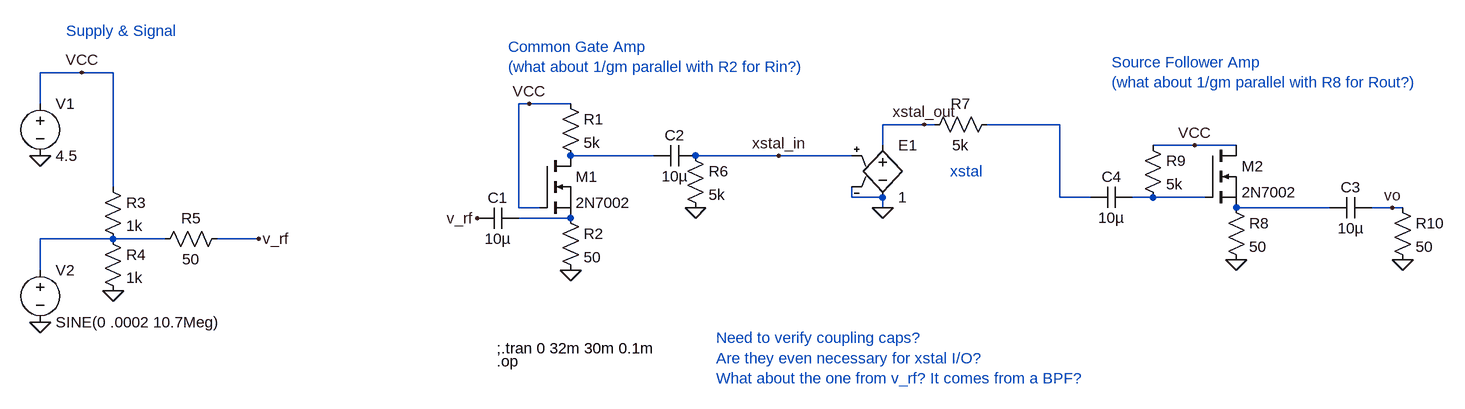
[diagram p0: schematic MOSFET_impedance_matching.asc]
MOSFET_impedance_matching.asc, the LTspice schematic file:
Version 4
SHEET 1 1732 680
WIRE -384 -144 -448 -144
WIRE -336 -144 -384 -144
WIRE -448 -96 -448 -144
WIRE 304 -96 288 -96
WIRE 368 -96 304 -96
WIRE 912 -64 848 -64
WIRE 928 -64 912 -64
WIRE 1120 -64 1008 -64
WIRE 848 -32 848 -64
WIRE 1328 -32 1264 -32
WIRE 1392 -32 1328 -32
WIRE 496 -16 368 -16
WIRE 688 -16 560 -16
WIRE 800 -16 688 -16
WIRE -336 32 -336 -144
WIRE 800 48 800 32
WIRE 848 48 800 48
WIRE 1120 48 1120 -64
WIRE 1168 48 1120 48
WIRE 1264 48 1232 48
WIRE 1344 48 1264 48
WIRE 288 64 288 -96
WIRE 320 64 288 64
WIRE 848 64 848 48
WIRE 1536 64 1392 64
WIRE 1632 64 1600 64
WIRE 1648 64 1632 64
WIRE 368 80 288 80
WIRE -336 112 -448 112
WIRE -256 112 -336 112
WIRE -112 112 -176 112
WIRE -448 160 -448 112
FLAG -448 -16 0
FLAG -448 240 0
FLAG -112 112 v_rf
FLAG -336 192 0
FLAG -384 -144 VCC
FLAG 224 80 v_rf
FLAG 304 -96 VCC
FLAG 560 64 0
FLAG 368 160 0
FLAG 848 64 0
FLAG 688 -16 xstal_in
FLAG 912 -64 xstal_out
FLAG 1328 -32 VCC
FLAG 1392 144 0
FLAG 1632 64 vo
FLAG 1648 144 0
SYMBOL nmos 320 -16 R0
SYMATTR InstName M1
SYMATTR Value 2N7002
SYMBOL voltage -448 -112 R0
WINDOW 123 0 0 Left 0
WINDOW 39 0 0 Left 0
SYMATTR InstName V1
SYMATTR Value 4.5
SYMBOL voltage -448 144 R0
WINDOW 123 0 0 Left 0
WINDOW 39 0 0 Left 0
SYMATTR InstName V2
SYMATTR Value SINE(0 .0002 10.7Meg)
SYMBOL res 352 -112 R0
SYMATTR InstName R1
SYMATTR Value 5k
SYMBOL res 352 64 R0
SYMATTR InstName R2
SYMATTR Value 50
SYMBOL res -352 16 R0
SYMATTR InstName R3
SYMATTR Value 1k
SYMBOL res -352 96 R0
SYMATTR InstName R4
SYMATTR Value 1k
SYMBOL res -160 96 R90
WINDOW 0 0 56 VBottom 2
WINDOW 3 32 56 VTop 2
SYMATTR InstName R5
SYMATTR Value 50
SYMBOL cap 288 64 R90
WINDOW 0 0 32 VBottom 2
WINDOW 3 32 32 VTop 2
SYMATTR InstName C1
SYMATTR Value 10µ
SYMBOL cap 560 -32 R90
WINDOW 0 0 32 VBottom 2
WINDOW 3 32 32 VTop 2
SYMATTR InstName C2
SYMATTR Value 10µ
SYMBOL res 544 -32 R0
SYMATTR InstName R6
SYMATTR Value 5k
SYMBOL e 848 -48 R0
SYMATTR InstName E1
SYMATTR Value 1
SYMBOL res 1024 -80 R90
WINDOW 0 0 56 VBottom 2
WINDOW 3 32 56 VTop 2
SYMATTR InstName R7
SYMATTR Value 5k
SYMBOL nmos 1344 -32 R0
SYMATTR InstName M2
SYMATTR Value 2N7002
SYMBOL res 1376 48 R0
SYMATTR InstName R8
SYMATTR Value 50
SYMBOL res 1248 -48 R0
SYMATTR InstName R9
SYMATTR Value 5k
SYMBOL cap 1600 48 R90
WINDOW 0 0 32 VBottom 2
WINDOW 3 32 32 VTop 2
SYMATTR InstName C3
SYMATTR Value 10µ
SYMBOL cap 1232 32 R90
WINDOW 0 0 32 VBottom 2
WINDOW 3 32 32 VTop 2
SYMATTR InstName C4
SYMATTR Value 10µ
SYMBOL res 1632 48 R0
SYMATTR InstName R10
SYMATTR Value 50
TEXT 254 280 Left 2 !;.tran 0 32m 30m 0.1m
TEXT 272 -184 Left 2 ;Common Gate Amp\n(what about 1/gm parallel with R2 for Rin?)
TEXT 1200 -160 Left 2 ;Source Follower Amp\n(what about 1/gm parallel with R8 for Rout?)
TEXT 952 8 Left 2 ;xstal
TEXT 592 264 Left 2 ;Need to verify coupling caps?\nAre they even necessary for xstal I/O?\nWhat about the one from v_rf? It comes from a BPF?
TEXT -408 -208 Left 2 ;Supply & Signal
TEXT 254 300 Left 2 !.op

The netlist it stands for:
* MOSFET_impedance_matching.asc
M1 N002 VCC N005 N005 2N7002
V1 VCC 0 4.5
V2 N006 0 SINE(0 .0002 10.7Meg)
R1 VCC N002 5k
R2 N005 0 50
R3 VCC N006 1k
R4 N006 0 1k
R5 v_rf N006 50
C1 N005 v_rf 10µ
C2 xstal_in N002 10µ
R6 xstal_in 0 5k
E1 xstal_out 0 xstal_in 0 1
R7 N001 xstal_out 5k
M2 VCC N003 N004 N004 2N7002
R8 N004 0 50
R9 VCC N003 5k
C3 vo N004 10µ
C4 N003 N001 10µ
R10 vo 0 50
.model NMOS NMOS
.model PMOS PMOS
.lib standard.mos
;.tran 0 32m 30m 0.1m
* Common Gate Amp
* (what about 1/gm parallel with R2 for Rin?)
* Source Follower Amp
* (what about 1/gm parallel with R8 for Rout?)
* xstal
* Need to verify coupling caps?
* Are they even necessary for xstal I/O?
* What about the one from v_rf? It comes from a BPF?
* Supply & Signal
.op
.backanno
.end